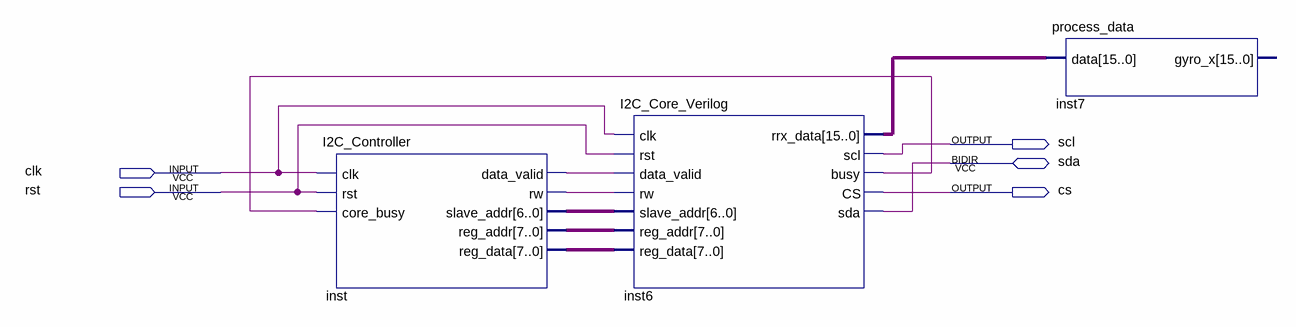
[diagram p0: schematic sheet]
// Quartus schematic i2c_testing.bdf as structural Verilog: 3 symbols, 5 pins
module i2c_testing (
  input  clk,
  input  rst,
  inout  sda,
  output scl,
  output cs
);

  wire inst6_busy, inst_data_valid, inst_rw;
  wire [6:0] inst_slave_addr;
  wire [7:0] inst_reg_addr, inst_reg_data;
  wire [15:0] inst6_rrx_data;

  I2C_Controller inst (
    .clk(clk), .rst(rst), .core_busy(inst6_busy), .data_valid(inst_data_valid), .rw(inst_rw),
    .slave_addr(inst_slave_addr), .reg_addr(inst_reg_addr), .reg_data(inst_reg_data));
  I2C_Core_Verilog inst6 (
    .clk(clk), .rst(rst), .data_valid(inst_data_valid), .rw(inst_rw), .slave_addr(inst_slave_addr),
    .reg_addr(inst_reg_addr), .reg_data(inst_reg_data), .rrx_data(inst6_rrx_data), .scl(scl),
    .busy(inst6_busy), .CS(cs), .sda(sda));
  process_data inst7 (.data(inst6_rrx_data));  // open: gyro_x
endmodule
